# EAGLE schematic RAFT_DuckLink_UART_Bridge (EAGLE 9.5.2)
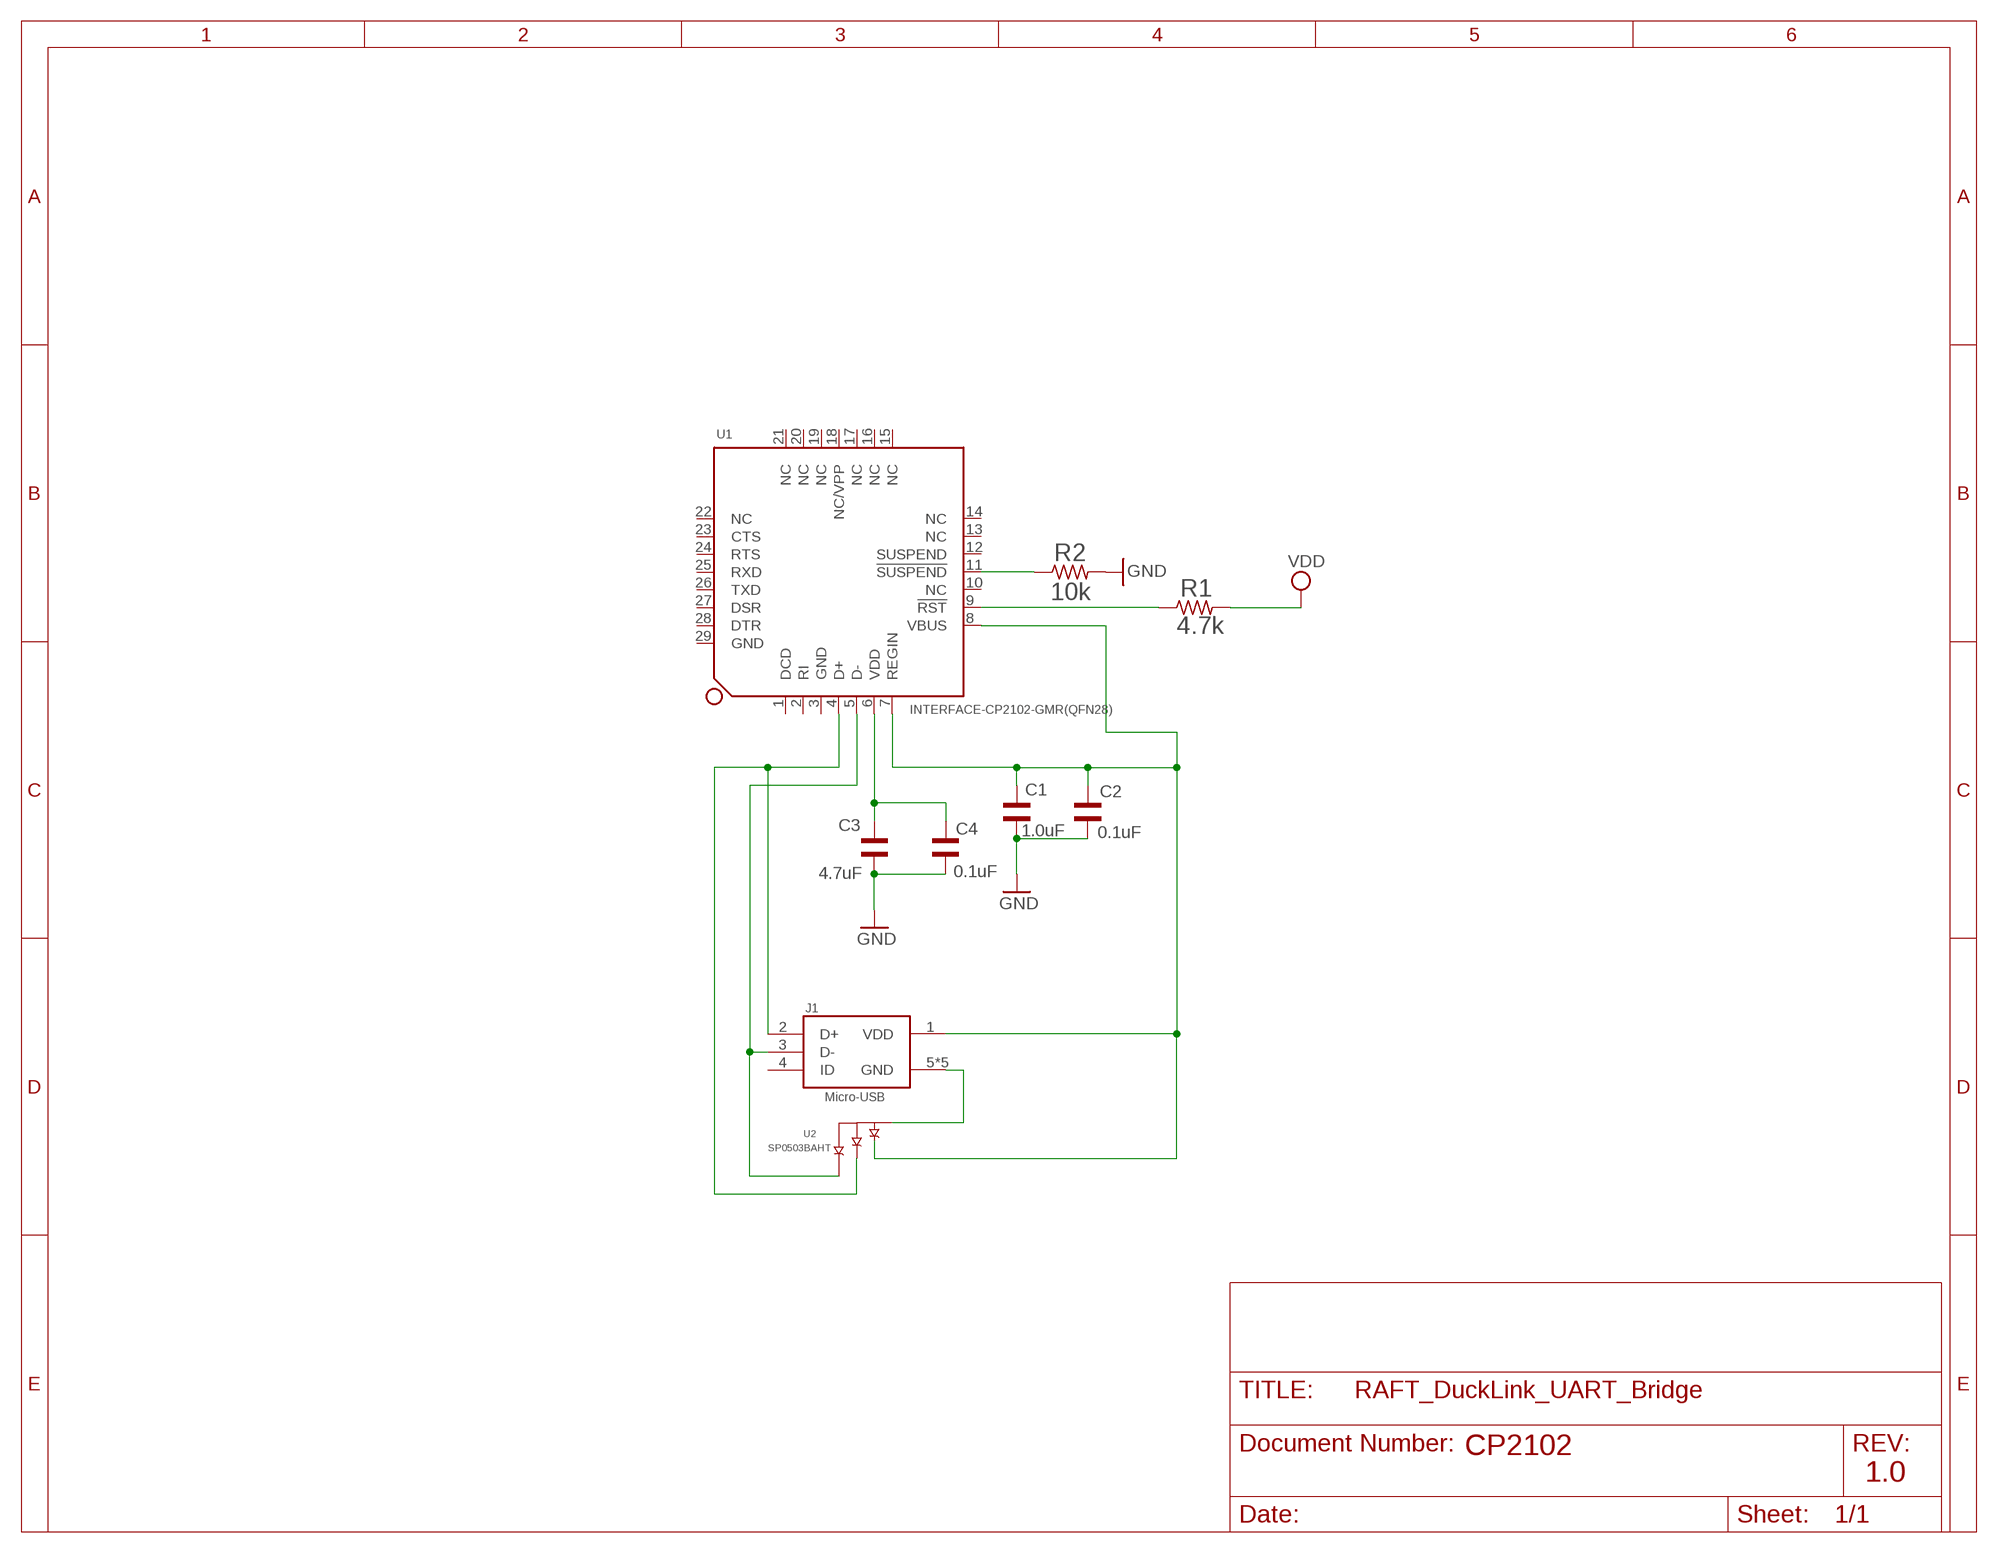
[diagram p0: schematic, sheet 1]

## Parts
C1  1.0uF  GCM155C71A105KE38D  [CAPC1005X70N]
C2  0.1uF  GRM155R71C104KA88D  [CAPC1005X55N]
C3  4.7uF  GRM155R60J475ME87D  [CAPC1005X55N]
C4  0.1uF  GRM155R71C104KA88D  [CAPC1005X55N]
J1  Micro-USB  105017-0001FIXED  [MOLEX_105017-0001]
R1  4.7k  CRCW04024K70JNEDC  [RESC1005X35N]
R2  10k  CRCW040210K0JNED  [RESC1005X40N]
U1  INTERFACE-CP2102-GMR(QFN28)  [QFN28G_0.5-5X5MM]
U2  SP0503BAHT  [SOT143]

## Nets
GND: C1.1 C2.1 C3.1 C4.1 R2.2
N$1: R1.1 U1.9(!RST)
N$2: R2.1 U1.11(!SUSPEND)
N$3: C1.2 C2.2 J1.1(VDD) U1.7(REGIN) U1.8(VBUS) U2.2(A)
N$4: C3.2 C4.2 U1.6(VDD)
N$5: J1.3(D-) U1.5(D-) U2.4(C)
N$6: J1.2(D+) U1.4(D+) U2.3(B)
N$7: J1.5(GND) J1.P$1(GND) J1.P$2(GND) J1.P$8(GND) J1.P$9(GND) U2.1(GND)
VDD: R1.2
Unconnected: J1.4(ID) U1.1(DCD) U1.2(RI) U1.3(GND) U1.10(NC) U1.12(SUSPEND) U1.13(NC) U1.14(NC) U1.15(NC) U1.16(NC) U1.17(NC) U1.18(NC/VPP) U1.19(NC) U1.20(NC) U1.21(NC) U1.22(NC) U1.23(CTS) U1.24(RTS) U1.25(RXD) U1.26(TXD) U1.27(DSR) U1.28(DTR) U1.29(GND)

## Notes on the sheet
- CP2102
- 1.0

## Library data of the parts
C1 = GCM155C71A105KE38D:GCM155C71A105KE38D: Cap Ceramic 1uF 10V X7S 10% Pad SMD 0402 125C Automotive T/R; AVAILABILITY: Unavailable; DESCRIPTION: Cap Ceramic 1uF 10V X7S 10% Pad SMD 0402 125C Automotive T/R; MF: Murata; MP: GCM155C71A105KE38D; PACKAGE: 1005 Murata; PRICE: None
C2 C4 = GRM155R71C104KA88D:GRM155R71C104KA88D: CAP CER 0.1UF 16V 10% X7R 0402; AVAILABILITY: Unavailable; DESCRIPTION: 0.1µF ±10% 16V Ceramic Capacitor X7R 0402 _1005 Metric_; MF: Murata; MP: GRM155R71C104KA88D; PACKAGE: 1005 Taiyo Yuden; PRICE: None
C3 = GRM155R60J475ME87D:GRM155R60J475ME87D: Cap Ceramic 4.7uF 6.3V X5R 20% SMD 0402 85°C Paper T/R; AVAILABILITY: Unavailable; DESCRIPTION: 4.7µF ±20% 6.3V Ceramic Capacitor X5R 0402 _1005 Metric_; MF: Murata; MP: GRM155R60J475ME87D; PACKAGE: 1005 Taiyo Yuden; PRICE: None
J1 = 105017-0001:105017-0001; DESCRIPTION: USB - micro B USB 2.0 Receptacle Connector 5 Position Surface Mount, Right Angle; Through Hole; DIGI-KEY_PART_NUMBER: WM1399CT-ND; DIGI-KEY_PURCHASE_URL: https://www.digikey.com/product-detail/en/molex/1050170001/WM1399CT-ND/2350885?utm_source=snapeda&utm_medium=aggregator&utm_campaign=symbol; MF: Molex; MP: 1050170001; PACKAGE: None
R1 = CRCW04024K70JNEDC:CRCW04024K70JNEDC: D10/CRCW0402-C 200 4K7 5% ET7; DESCRIPTION: D10/CRCW0402-C 200 4K7 5% ET7; DIGI-KEY_PART_NUMBER: 541-3974-1-ND; DIGI-KEY_PURCHASE_URL: https://www.digikey.com/product-detail/en/vishay-dale/CRCW04024K70JNEDC/541-3974-1-ND/7928657?utm_source=snapeda&utm_medium=aggregator&utm_campaign=symbol; MF: Vishay; MP: CRCW04024K70JNEDC; PACKAGE: 1005 Yageo
R2 = CRCW040210K0JNED:CRCW040210K0JNED: RES, THICK FILM, 10K, 5%, 0.063W, 0402,; DESCRIPTION: 10 kOhms ±5% 0.063W, 1/16W Chip Resistor 0402 _1005 Metric_ Automotive AEC-Q200 Thick Film; DIGI-KEY_PART_NUMBER: 541-10KJCT-ND; DIGI-KEY_PURCHASE_URL: https://www.digikey.com/product-detail/en/vishay-dale/CRCW040210K0JNED/541-10KJCT-ND/1182708?utm_source=snapeda&utm_medium=aggregator&utm_campaign=symbol; MF: Vishay Dale; MP: CRCW040210K0JNED; PACKAGE: 1005 Panasonic Electronic Components
U1 = INTERFACE-CP2102-GMR_QFN28_:INTERFACE-CP2102-GMR(QFN28): 310070003; AVAILABILITY: Unavailable; DESCRIPTION: USB Bridge, USB to UART USB 2.0 UART Interface 28-QFN _5x5_; MF: Silicon; MP: CP2102-GMR; PACKAGE: VFQFN-28 Vishay Siliconix; PRICE: None
U2 = SP0503BAHT:SP0503BAHT; DESCRIPTION: 8.5V Clamp Ipp Tvs Diode Surface Mount SOT-143-4; DIGI-KEY_PART_NUMBER: SP0503BAHT-ND; DIGI-KEY_PURCHASE_URL: https://www.digikey.com/product-detail/en/littelfuse-inc/SP0503BAHT/SP0503BAHT-ND/485122?utm_source=snapeda&utm_medium=aggregator&utm_campaign=symbol; MF: Littelfuse Inc.; MP: SP0503BAHT; PACKAGE: SOT-143 Littelfuse